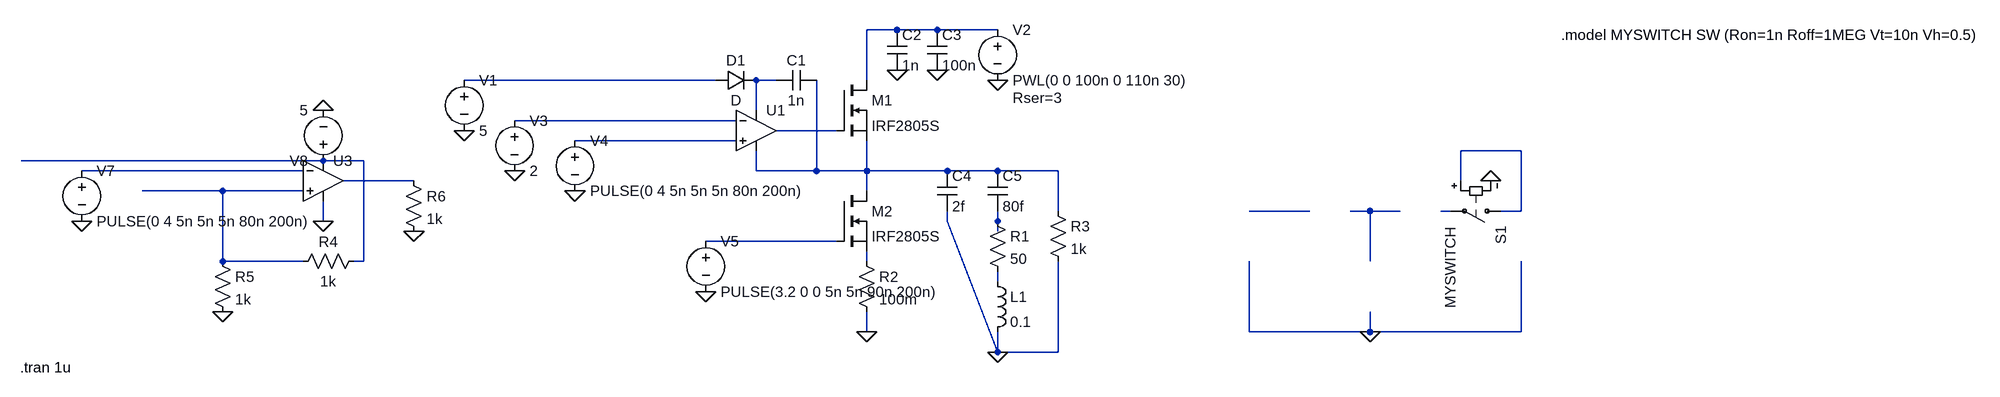
[diagram p0: schematic piezodriver1.asc]
piezodriver1.asc, the LTspice schematic file:
Version 4
SHEET 1 1328 680
WIRE -448 -32 -496 -32
WIRE -384 -32 -448 -32
WIRE -288 -32 -384 -32
WIRE -736 48 -1136 48
WIRE -640 48 -672 48
WIRE -496 48 -496 -32
WIRE -672 96 -672 48
WIRE -704 112 -1056 112
WIRE -544 128 -640 128
WIRE -704 144 -960 144
WIRE 544 160 448 160
WIRE -1360 176 -1840 176
WIRE -1296 176 -1360 176
WIRE -1392 192 -1744 192
WIRE -672 192 -672 160
WIRE -576 192 -576 48
WIRE -576 192 -672 192
WIRE -496 192 -496 144
WIRE -496 192 -576 192
WIRE -368 192 -496 192
WIRE -288 192 -368 192
WIRE -192 192 -288 192
WIRE -1216 208 -1328 208
WIRE 448 208 448 160
WIRE -1520 224 -1648 224
WIRE -1392 224 -1520 224
WIRE -496 224 -496 192
WIRE -192 256 -192 192
WIRE 208 256 112 256
WIRE 304 256 272 256
WIRE 352 256 304 256
WIRE 432 256 416 256
WIRE 544 256 544 160
WIRE 544 256 512 256
WIRE -1360 272 -1360 240
WIRE -368 272 -368 256
WIRE -288 272 -288 256
WIRE -288 288 -288 272
WIRE -544 304 -752 304
WIRE -1520 336 -1520 224
WIRE -1392 336 -1520 336
WIRE -1296 336 -1296 176
WIRE -1296 336 -1312 336
WIRE -496 336 -496 320
WIRE 304 336 304 256
WIRE -288 368 -288 352
WIRE -496 448 -496 416
WIRE 112 448 112 336
WIRE 304 448 304 416
WIRE 304 448 112 448
WIRE 544 448 544 336
WIRE 544 448 304 448
WIRE -288 480 -368 272
WIRE -288 480 -288 448
WIRE -192 480 -192 336
WIRE -192 480 -288 480
FLAG 304 448 0
FLAG 496 208 0
FLAG -960 224 0
FLAG -1056 192 0
FLAG -1136 128 0
FLAG -288 48 0
FLAG -496 448 0
FLAG -288 480 0
FLAG -752 384 0
FLAG -448 32 0
FLAG -384 32 0
FLAG -1744 272 0
FLAG -1360 272 0
FLAG -1360 96 0
FLAG -1216 288 0
FLAG -1520 416 0
SYMBOL res -304 256 R0
SYMATTR InstName R1
SYMATTR Value 50
SYMBOL cap -640 64 R270
WINDOW 0 32 32 VTop 2
WINDOW 3 0 32 VBottom 2
SYMATTR InstName C1
SYMATTR Value 1n
SYMBOL voltage -1136 32 R0
WINDOW 123 0 0 Left 0
WINDOW 39 24 124 Left 2
SYMATTR InstName V1
SYMATTR Value 5
SYMBOL voltage -288 -48 R0
WINDOW 123 0 0 Left 0
WINDOW 39 24 124 Left 2
SYMATTR InstName V2
SYMATTR Value PWL(0 0 100n 0 110n 30)
SYMATTR SpiceLine Rser=3
SYMBOL sw 528 256 R90
SYMATTR InstName S1
SYMATTR Value MYSWITCH
SYMBOL nmos -544 48 R0
SYMATTR InstName M1
SYMATTR Value IRF2805S
SYMBOL diode -736 64 R270
WINDOW 0 32 32 VTop 2
WINDOW 3 0 32 VBottom 2
SYMATTR InstName D1
SYMBOL voltage -1056 96 R0
WINDOW 123 0 0 Left 0
WINDOW 39 24 124 Left 2
SYMATTR InstName V3
SYMATTR Value 2
SYMBOL voltage -960 128 R0
WINDOW 123 0 0 Left 0
WINDOW 39 24 124 Left 2
SYMATTR InstName V4
SYMATTR Value PULSE(0 4 5n 5n 5n 80n 200n)
SYMBOL voltage -752 288 R0
WINDOW 123 0 0 Left 0
WINDOW 39 24 124 Left 2
SYMATTR InstName V5
SYMATTR Value PULSE(3.2 0 0 5n 5n 90n 200n)
SYMBOL cap -464 -32 R0
SYMATTR InstName C2
SYMATTR Value 1n
SYMBOL cap -400 -32 R0
SYMATTR InstName C3
SYMATTR Value 100n
SYMBOL cap -384 192 R0
SYMATTR InstName C4
SYMATTR Value 2f
SYMBOL cap -304 192 R0
SYMATTR InstName C5
SYMATTR Value 80f
SYMBOL ind -304 352 R0
SYMATTR InstName L1
SYMATTR Value 0.1
SYMBOL nmos -544 224 R0
SYMATTR InstName M2
SYMATTR Value IRF2805S
SYMBOL res -512 320 R0
SYMATTR InstName R2
SYMATTR Value 100m
SYMBOL res -208 240 R0
SYMATTR InstName R3
SYMATTR Value 1k
SYMBOL voltage -1744 176 R0
WINDOW 123 0 0 Left 0
WINDOW 39 24 124 Left 2
SYMATTR InstName V7
SYMATTR Value PULSE(0 4 5n 5n 5n 80n 200n)
SYMBOL voltage -1360 192 R180
WINDOW 123 0 0 Left 0
WINDOW 39 24 124 Left 2
SYMATTR InstName V8
SYMATTR Value 5
SYMBOL res -1232 192 R0
SYMATTR InstName R6
SYMATTR Value 1k
SYMBOL OpAmps\\UniversalOpAmp2 -1360 208 R0
SYMATTR InstName U3
SYMATTR Value2 Avol=1Meg GBW=100Meg Slew=1000Meg
SYMATTR SpiceLine Ilimit=100m Rail=0 Vos=0
SYMBOL res -1408 352 R270
WINDOW 0 32 56 VTop 2
WINDOW 3 0 56 VBottom 2
SYMATTR InstName R4
SYMATTR Value 1k
SYMBOL res -1536 320 R0
SYMATTR InstName R5
SYMATTR Value 1k
SYMBOL OpAmps\\UniversalOpAmp2 -672 128 R0
SYMATTR InstName U1
SYMATTR Value2 Avol=1Meg GBW=100Meg Slew=100Meg
TEXT 608 -24 Left 2 !.model MYSWITCH SW (Ron=1n Roff=1MEG Vt=10n Vh=0.5)
TEXT -1842 504 Left 2 !.tran 1u

The netlist it stands for:
* piezodriver1.asc
R1 N016 N019 50
C1 N003 N010 1n
V1 N002 0 5
V2 N001 0 PWL(0 0 100n 0 110n 30) Rser=3
S1 N007 N015 N007 0 MYSWITCH
M1 N001 N005 N010 N010 IRF2805S
D1 N002 N003 D
V3 N004 0 2
V4 N006 0 PULSE(0 4 5n 5n 5n 80n 200n)
V5 N017 0 PULSE(3.2 0 0 5n 5n 90n 200n)
C2 N001 0 1n
C3 N001 0 100n
C4 N010 0 2f
C5 N010 N016 80f
L1 N019 0 0.1
M2 N010 N017 N018 N018 IRF2805S
R2 N018 0 100m
R3 N010 0 1k
V7 N009 0 PULSE(0 4 5n 5n 5n 80n 200n)
V8 N008 0 5
R6 N011 0 1k
XU3 N012 N009 N008 0 N011 level2 Avol=1Meg GBW=100Meg Slew=1000Meg Ilimit=100m Rail=0 Vos=0 En=0 Enk=0 In=0 Ink=0 Rin=500Meg  ; pins In+ In- V+ V- OUT
R4 N012 N008 1k
R5 N012 0 1k
XU1 N006 N004 N003 N010 N005 level2 Avol=1Meg GBW=100Meg Slew=100Meg Ilimit=25m Rail=0 Vos=0 En=0 Enk=0 In=0 Ink=0 Rin=500Meg  ; pins In+ In- V+ V- OUT
.model D D
.lib standard.dio
.model NMOS NMOS
.model PMOS PMOS
.lib standard.mos
.model MYSWITCH SW (Ron=1n Roff=1MEG Vt=10n Vh=0.5)
.tran 1u
.lib UniversalOpAmp2.lib
.backanno
.end